# EAGLE design 2d printer (EAGLE 9.3.0)
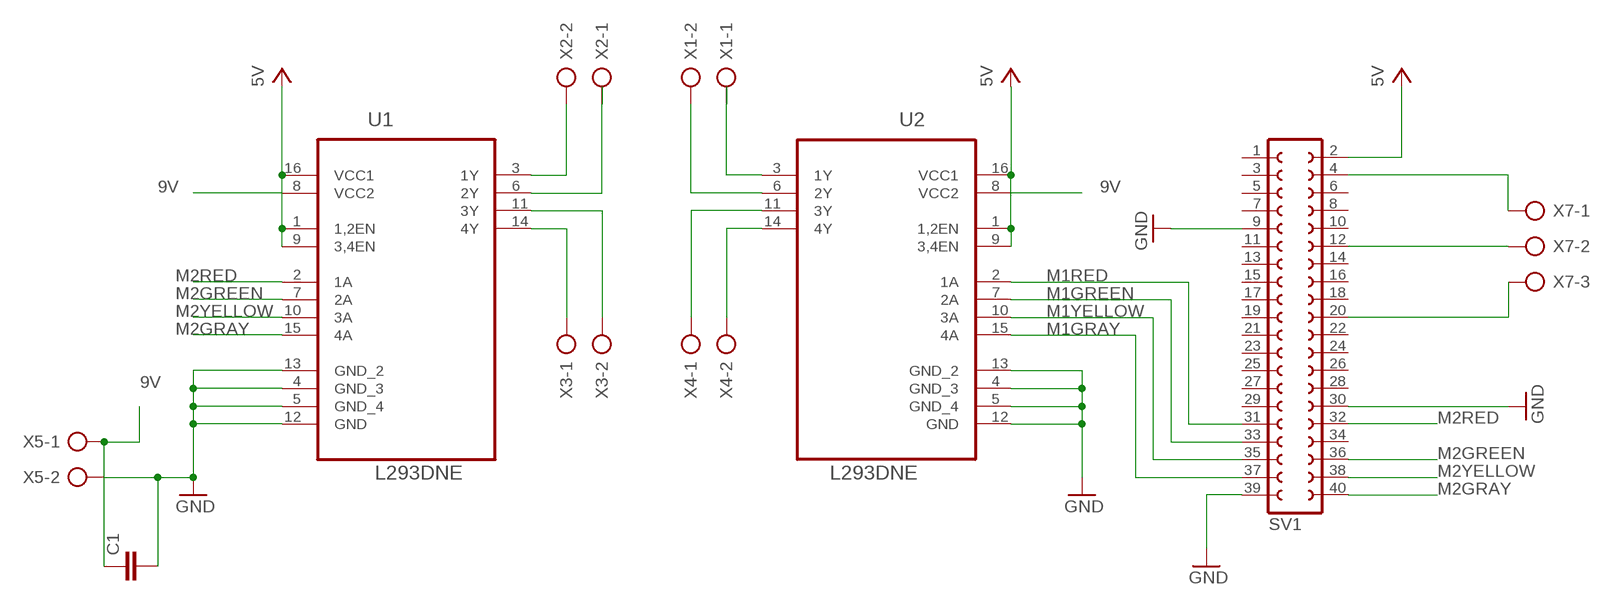
[diagram p0: schematic, sheet 1]

## Parts
C1  C2.5/2  [C2.5-2]
SV1  FE20-2  [FE20-2]
U1  L293DNE  [DIP254P762X508-16]
U2  L293DNE  [DIP254P762X508-16]
X1  AK300/2  [AK300/2]
X2  AK300/2  [AK300/2]
X3  AK300/2  [AK300/2]
X4  AK300/2  [AK300/2]
X5  AK300/2  [AK300/2]
X7  AK300/3  [AK300/3]

## Nets
9V: C1.1 U1.8(VCC2) U2.8(VCC2) X5.1
GND: C1.2 SV1.9 SV1.30 SV1.39 U1.4(GND_3) U1.5(GND_4) U1.12(GND) U1.13(GND_2) U2.4(GND_3) U2.5(GND_4) U2.12(GND) U2.13(GND_2) X5.2
M1GRAY: SV1.37 U2.15(4A)
M1GREEN: SV1.33 U2.7(2A)
M1RED: SV1.31 U2.2(1A)
M1YELLOW: SV1.35 U2.10(3A)
M2GRAY: SV1.40 U1.15(4A)
M2GREEN: SV1.36 U1.7(2A)
M2RED: SV1.32 U1.2(1A)
M2YELLOW: SV1.38 U1.10(3A)
N$1: U2.3(1Y) X1.1
N$2: U1.3(1Y) X2.2
N$3: U1.6(2Y) X2.1
N$4: U1.14(4Y) X3.1
N$5: U1.11(3Y) X3.2
N$6: U2.14(4Y) X4.2
N$7: U2.6(2Y) X1.2
N$8: U2.11(3Y) X4.1
N$18: SV1.4 X7.1
N$19: SV1.20 X7.3
N$20: SV1.12 X7.2
VCC: SV1.2 U1.1(1,2EN) U1.9(3,4EN) U1.16(VCC1) U2.1(1,2EN) U2.9(3,4EN) U2.16(VCC1) ; supply symbol labelled 5V
Unconnected: SV1.1 SV1.3 SV1.5 SV1.6 SV1.7 SV1.8 SV1.10 SV1.11 SV1.13 SV1.14 SV1.15 SV1.16 SV1.17 SV1.18 SV1.19 SV1.21 SV1.22 SV1.23 SV1.24 SV1.25 SV1.26 SV1.27 SV1.28 SV1.29 SV1.34

## Library data of the parts
C1 = capacitor-wima:C: CAPACITOR naming: grid - package width
SV1 = con-lsta:FE20-2: FEMALE HEADER; OC_FARNELL: unknown; OC_NEWARK: unknown
U1 U2 = L293DNE:L293DNE: QUADRUPLE HALF-H DRIVERS; AVAILABILITY: Unavailable; DESCRIPTION: Logic - Buffers, Drivers, and Transceivers Quad Half-Hs; MF: Texas Instruments; MP: L293DNE; PACKAGE: DIP-16 Texas Instruments; PRICE: None
X1-X5 = con-ptr500:AK300/2: CONNECTOR; OC_FARNELL: unknown; OC_NEWARK: unknown
X7 = con-ptr500:AK300/3: CONNECTOR; OC_FARNELL: unknown; OC_NEWARK: unknown

## Net classes
0 default: width 0.305 mm, drill 0.508 mm, clearance 0.381 mm

## Board
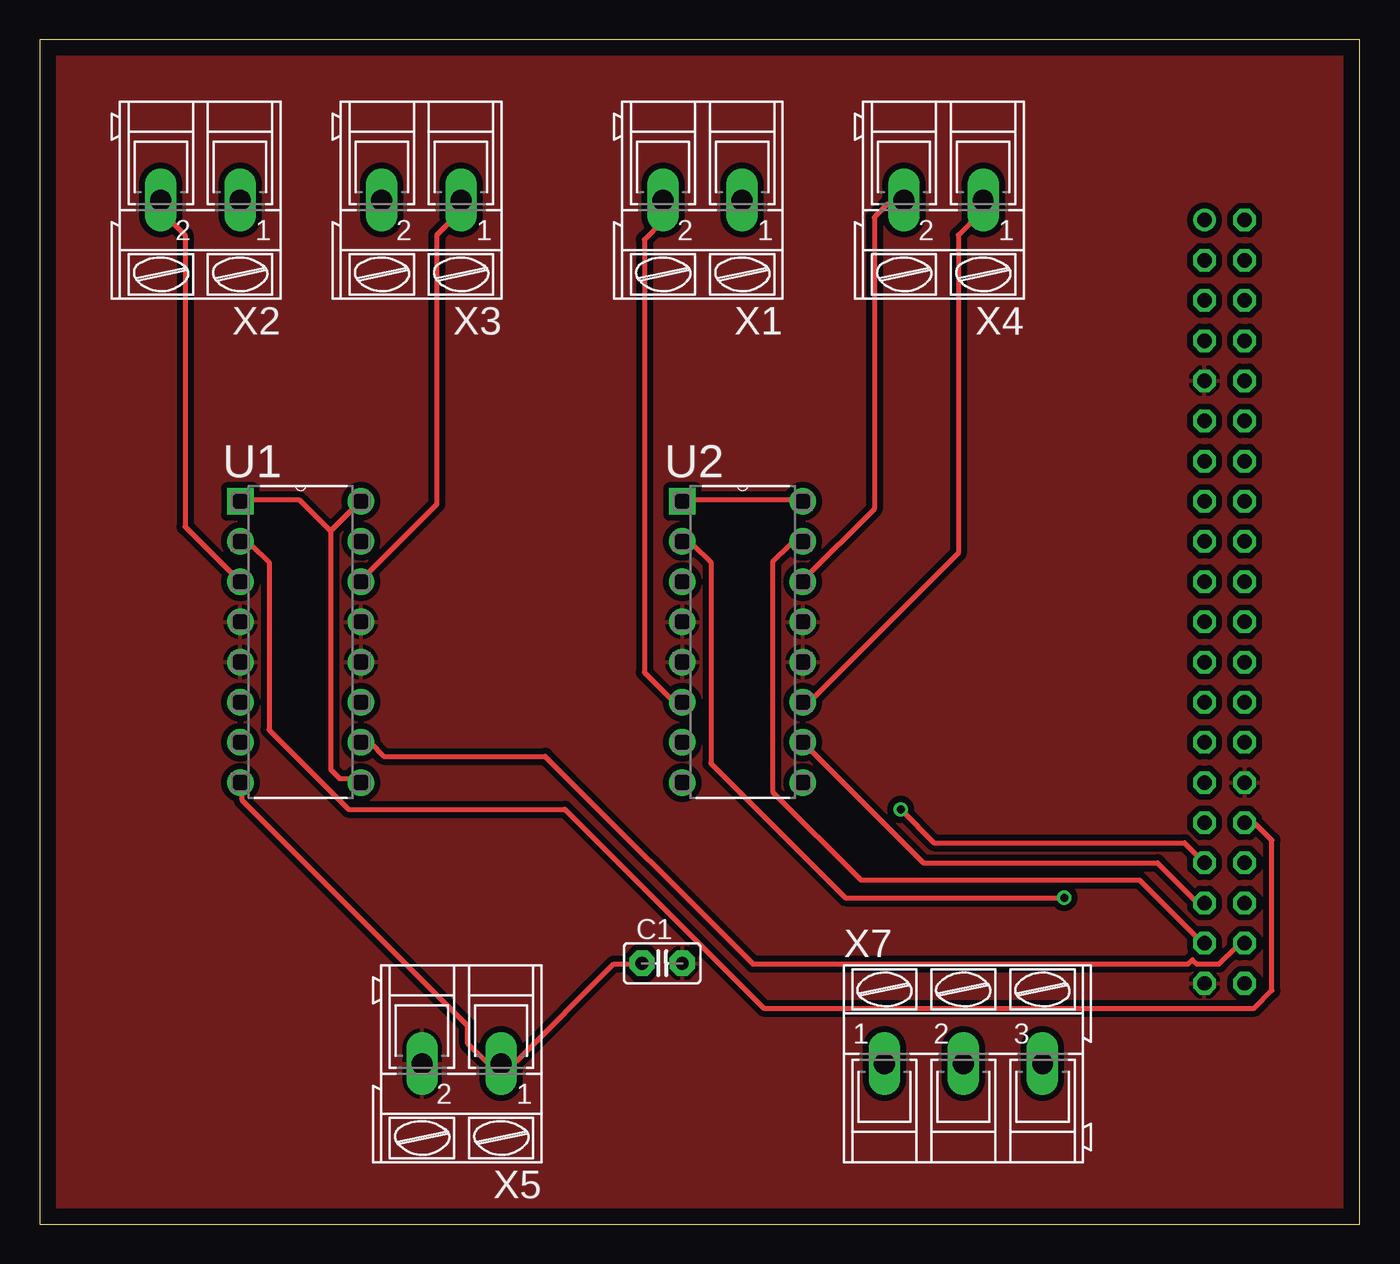
[diagram p1: board, top side]
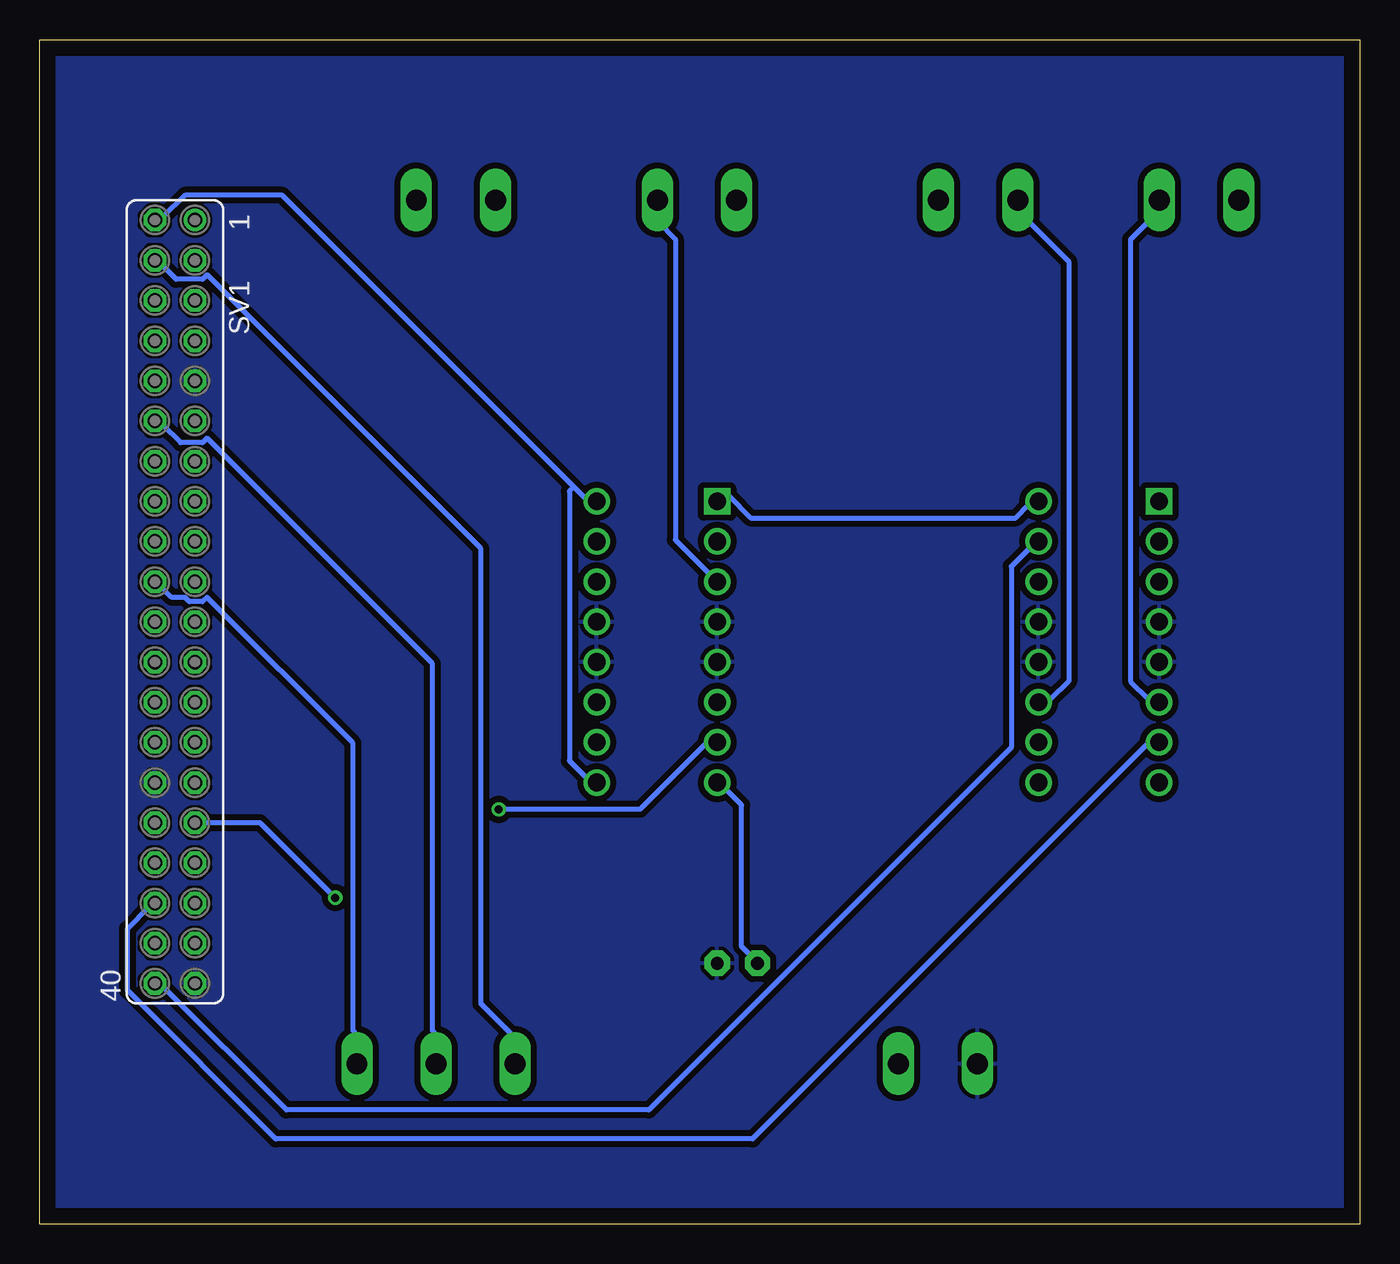
[diagram p2: board, bottom side, seen from below]

Size 83.49 x 74.92 mm. Coordinates in mm from the lower left corner, seen from the top.
Outline: 0,0 83.49,0 83.49,74.92 0,74.92 0,0
Copper layers (1*16): Top 0.035mm / dielectric 1.5mm / Bottom 0.035mm
Design rules "default": minimum track width 6mil, minimum drill 0.35mm, track to track 6mil, track to pad 6mil, pad to pad 6mil, via to via 6mil, smd to smd 6mil, copper to edge 40mil, drill to drill 6mil, minimum pad ring 10mil, minimum via ring 8mil, stop-mask expansion 4mil, vias tented up to drill 0mil, thermal gap 10mil

### Footprints (pad centres in the part's own frame; a part is rotated, then mirrored left to right if it is on the bottom)
C2.5-2 = drill 0.813 pad 1.6 octagon: 1 -1.27,0; 2 1.27,0
FE20-2 = drill 0.914: 1 -24.13,1.27 | drill 0.914 octagon: 2 -24.13,-1.27; 3 -21.59,1.27; 4 -21.59,-1.27; 5 -19.05,1.27; 6 -19.05,-1.27; 7 -16.51,1.27; 8 -16.51,-1.27; 9 -13.97,1.27; 10 -13.97,-1.27; 11 -11.43,1.27; 12 -11.43,-1.27; 13 -8.89,1.27; 14 -8.89,-1.27; 15 -6.35,1.27; 16 -6.35,-1.27; 17 -3.81,1.27; 18 -3.81,-1.27; 19 -1.27,1.27; 20 -1.27,-1.27; 21 1.27,1.27; 22 1.27,-1.27; 23 3.81,1.27; 24 3.81,-1.27; 25 6.35,1.27; 26 6.35,-1.27; 27 8.89,1.27; 28 8.89,-1.27; 29 11.43,1.27; 30 11.43,-1.27; 31 13.97,1.27; 32 13.97,-1.27; 33 16.51,1.27; 34 16.51,-1.27; 35 19.05,1.27; 36 19.05,-1.27; 37 21.59,1.27; 38 21.59,-1.27; 39 24.13,1.27; 40 24.13,-1.27
DIP254P762X508-16 = drill 1.118 square: 1 -7.62,17.78 | drill 1.118: 2 -7.62,15.24; 3 -7.62,12.7; 4 -7.62,10.16; 5 -7.62,7.62; 6 -7.62,5.08; 7 -7.62,2.54; 8 -7.62,0; 9 0,0; 10 0,2.54; 11 0,5.08; 12 0,7.62; 13 0,10.16; 14 0,12.7; 15 0,15.24; 16 0,17.78
AK300/2 = drill 1.321 long: 1 -2.515,0; 2 2.489,0
AK300/3 = drill 1.321 long: 1 -5.004,0; 2 0,0; 3 5.004,0

### Placement (x,y rotation side)
C1  39.37,16.51 0 top
SV1  74.93,39.37 270 bottom
U1  20.32,27.94 0 top
U2  48.26,27.94 0 top
X1  41.91,64.77 180 top
X2  10.16,64.77 180 top
X3  24.13,64.77 180 top
X4  57.15,64.77 180 top
X5  26.67,10.16 180 top
X7  58.42,10.16 0 top

### Tracks (layer width: path | path; a pad name or v marks a point on that pad's centre or on a via)
9V
  Top 0.305: C1.1 37.97,16.46 36.3,16.46 30.15,10.31 29.31,10.31 X5.1 29.03,10.31 28.19,10.31 27.08,11.43 27.08,12.55 12.83,26.8 12.83,27.91 U1.8
  Bottom 0.305: U2.8 40.49,27.91 39.09,26.52 39.09,17.58 38.53,17.02 38.25,17.02 37.97,16.74 C1.1
GND
  pour Top: -1.27,76.2 85.09,76.2 85.09,-1.27 0,-1.27 -1.27,-1.27
  pour Bottom: -2.54,77.47 86.36,77.47 86.36,-2.54 -2.54,-2.54
M1GRAY
  Top 0.305: SV1.37 73.46,17.86 69.55,21.77 51.94,21.77 46.36,27.36 46.36,41.88 47.47,43 48.03,43 U2.15
M1GREEN  (via drill 0.51)
  Top 0.305: v54.46,26.24 56.57,24.13 72.39,24.13 SV1.33
  Bottom 0.305: v54.46,26.24 45.52,26.24 41.33,30.43 40.77,30.43 U2.7
M1RED  (via drill 0.51)
  Top 0.305: v64.8,20.65 50.95,20.65 42.44,29.16 42.44,41.88 41.33,43 40.77,43 U2.2
  Bottom 0.305: SV1.31 69.55,25.4 v64.8,20.65
M1YELLOW
  Top 0.305: 48.87,30.43 48.31,30.43 U2.10 55.88,22.86 70.69,22.86 73.18,20.37 73.46,20.37 SV1.35
M2GRAY
  Bottom 0.305: SV1.40 75.97,15.06 75.69,15.06 67.87,7.24 44.96,7.24 22.05,30.15 22.05,41.61 20.37,43.28 U1.15
M2GREEN
  Bottom 0.305: SV1.36 76.25,20.09 76.53,20.09 77.93,18.69 77.93,14.78 68.55,5.41 38.41,5.41 13.39,30.43 12.83,30.43 U1.7
M2RED
  Top 0.305: SV1.32 76.81,25.4 77.93,24.28 77.93,14.78 76.81,13.66 45.8,13.66 33.22,26.24 19.53,26.24 14.5,31.27 14.5,41.88 13.39,43 12.83,43 U1.2
M2YELLOW
  Top 0.305: SV1.38 75.97,17.58 75.69,17.58 74.57,16.46 73.18,16.46 72.9,16.74 72.62,16.46 45.11,16.46 31.98,29.59 21.77,29.59 20.93,30.43 20.37,30.43 U1.10
N$1
  Bottom 0.305: U2.3 43.28,43.28 43.28,62.28 44.4,63.4 44.4,64.52 X1.1
N$2
  Top 0.305: U1.3 12.55,40.77 9.19,44.12 9.19,62.56 7.8,63.96 7.8,64.52 X2.2
N$3
  Bottom 0.305: U1.6 12.83,33.22 13.39,33.22 14.5,34.34 14.5,62.28 12.83,63.96 12.83,64.52 X2.1
N$4
  Top 0.305: U1.14 20.37,40.77 25.12,45.52 25.12,62.56 26.52,63.96 26.52,64.52 X3.1
N$5
  Bottom 0.305: U1.11 20.09,33.22 19.53,33.22 18.41,34.34 18.41,60.88 21.49,63.96 21.49,64.52 X3.2
N$6
  Top 0.305: U2.14 48.31,40.77 52.78,45.24 52.78,63.68 53.62,64.52 54.46,64.52 X4.2
N$7
  Top 0.305: U2.6 40.49,33.22 39.93,33.22 38.25,34.9 38.25,62.28 39.37,63.4 39.37,64.52 X1.2
N$8
  Top 0.305: U2.11 48.31,33.22 48.87,33.22 58.09,42.44 58.09,62.56 59.49,63.96 59.49,64.52 X4.1
N$18
  Bottom 0.305: SV1.4 75.97,60.88 74.85,59.77 73.18,59.77 72.9,60.05 55.57,42.72 55.57,13.95 53.62,11.99 53.62,10.31 X7.1
N$19
  Bottom 0.305: SV1.20 75.97,40.49 75.13,39.65 74.3,39.65 74.02,39.37 73.18,39.37 72.9,39.65 63.68,30.43 63.68,12.27 63.4,11.99 63.4,10.31 X7.3
N$20
  Bottom 0.305: SV1.12 75.97,50.55 75.69,50.55 74.57,49.43 73.18,49.43 72.9,49.71 58.65,35.46 58.65,12.27 58.37,11.99 58.37,10.31 X7.2
VCC
  Top 0.305: 18.41,43.84 18.41,28.75 18.97,28.19 20.09,28.19 U1.9 | 18.41,43.84 19.81,45.24 19.81,45.52 20.09,45.8 U1.16 | 18.41,43.84 16.46,45.8 12.83,45.8 U1.1 | U2.1 40.77,45.8 48.03,45.8 U2.16
  Bottom 0.305: 49.71,46.63 48.87,45.8 48.31,45.8 U2.16 | 49.71,46.63 68.15,65.07 74.3,65.07 75.69,63.68 75.97,63.68 SV1.2 | 49.71,46.63 49.99,46.36 49.99,29.31 48.87,28.19 48.31,28.19 U2.9 | U1.16 20.37,45.52 20.93,45.52 21.77,44.68 38.53,44.68 39.93,46.08 40.21,46.08 40.49,45.8 U2.1